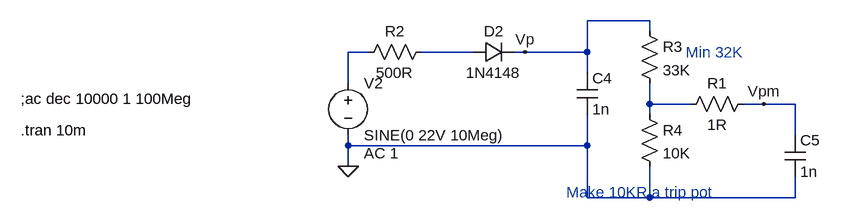
[diagram p0: schematic PMeter Detector.asc]
PMeter Detector.asc, the LTspice schematic file:
Version 4
SHEET 1 1416 708
WIRE 1120 64 1024 64
WIRE 1120 80 1120 64
WIRE 688 112 656 112
WIRE 848 112 768 112
WIRE 928 112 912 112
WIRE 1024 112 1024 64
WIRE 1024 112 928 112
WIRE 1024 144 1024 112
WIRE 656 160 656 112
WIRE 1120 192 1120 160
WIRE 1184 192 1120 192
WIRE 1296 192 1264 192
WIRE 1344 192 1296 192
WIRE 1120 208 1120 192
WIRE 1344 240 1344 192
WIRE 656 256 656 240
WIRE 1024 256 1024 208
WIRE 1024 256 656 256
WIRE 656 288 656 256
WIRE 1024 336 1024 256
WIRE 1120 336 1120 288
WIRE 1120 336 1024 336
WIRE 1344 336 1344 304
WIRE 1344 336 1120 336
FLAG 656 288 0
FLAG 928 112 Vp
FLAG 1296 192 Vpm
SYMBOL voltage 656 144 R0
WINDOW 123 24 124 Left 2
WINDOW 39 0 0 Left 2
SYMATTR Value2 AC 1
SYMATTR InstName V2
SYMATTR Value SINE(0 22V 10Meg)
SYMBOL diode 848 128 R270
WINDOW 0 32 32 VTop 2
WINDOW 3 0 32 VBottom 2
SYMATTR InstName D2
SYMATTR Value 1N4148
SYMBOL cap 1008 144 R0
SYMATTR InstName C4
SYMATTR Value 1n
SYMBOL res 1104 64 R0
SYMATTR InstName R3
SYMATTR Value 33K
SYMBOL res 1104 192 R0
SYMATTR InstName R4
SYMATTR Value 10K
SYMBOL cap 1328 240 R0
SYMATTR InstName C5
SYMATTR Value 1n
SYMBOL res 1280 176 R90
WINDOW 0 0 56 VBottom 2
WINDOW 3 32 56 VTop 2
SYMATTR InstName R1
SYMATTR Value 1R
SYMBOL res 784 96 R90
WINDOW 0 0 56 VBottom 2
WINDOW 3 32 56 VTop 2
SYMATTR InstName R2
SYMATTR Value 500R
TEXT 152 232 Left 2 !.tran 10m
TEXT 992 328 Left 2 ;Make 10KR a trip pot
TEXT 1176 112 Left 2 ;Min 32K
TEXT 152 184 Left 2 !;ac dec 10000 1 100Meg

The netlist it stands for:
* PMeter Detector.asc
V2 N001 0 SINE(0 22V 10Meg) AC 1
D2 N002 Vp 1N4148
C4 Vp 0 1n
R3 Vp N003 33K
R4 N003 0 10K
C5 Vpm 0 1n
R1 Vpm N003 1R
R2 N002 N001 500R
.model D D
.lib standard.dio
.tran 10m
* Make 10KR a trip pot
* Min 32K
;ac dec 10000 1 100Meg
.backanno
.end